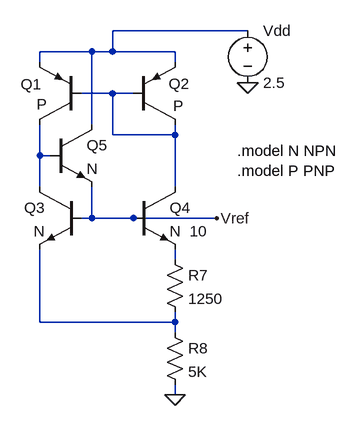
[diagram p0: schematic bandgap_reference.asc]
bandgap_reference.asc, the LTspice schematic file:
Version 4
SHEET 1 1832 680
WIRE 1696 -160 1488 -160
WIRE 1456 -128 1376 -128
WIRE 1488 -128 1488 -160
WIRE 1488 -128 1456 -128
WIRE 1584 -128 1488 -128
WIRE 1376 -112 1376 -128
WIRE 1584 -112 1584 -128
WIRE 1488 -64 1440 -64
WIRE 1520 -64 1488 -64
WIRE 1456 -16 1456 -128
WIRE 1488 0 1488 -64
WIRE 1584 0 1584 -16
WIRE 1584 0 1488 0
WIRE 1376 32 1376 -16
WIRE 1392 32 1376 32
WIRE 1376 80 1376 32
WIRE 1584 80 1584 0
WIRE 1456 128 1456 80
WIRE 1456 128 1440 128
WIRE 1520 128 1456 128
WIRE 1648 128 1520 128
WIRE 1584 192 1584 176
WIRE 1376 288 1376 176
WIRE 1584 288 1584 272
WIRE 1584 288 1376 288
WIRE 1584 304 1584 288
WIRE 1584 400 1584 384
FLAG 1584 400 0
FLAG 1648 128 Vref
FLAG 1696 -80 0
SYMBOL pnp 1440 -16 R180
WINDOW 0 61 62 Left 2
WINDOW 3 53 31 Left 2
SYMATTR InstName Q1
SYMATTR Value P
SYMBOL pnp 1520 -16 M180
WINDOW 0 54 63 Left 2
WINDOW 3 61 29 Left 2
SYMATTR InstName Q2
SYMATTR Value P
SYMBOL res 1568 176 R0
SYMATTR InstName R7
SYMATTR Value 1250
SYMBOL npn 1440 80 M0
SYMATTR InstName Q3
SYMATTR Value N
SYMBOL npn 1520 80 R0
SYMATTR InstName Q4
SYMATTR Value N  10
SYMBOL res 1568 288 R0
SYMATTR InstName R8
SYMATTR Value 5K
SYMBOL npn 1392 -16 R0
SYMATTR InstName Q5
SYMATTR Value N
SYMBOL voltage 1696 -176 R0
SYMATTR InstName Vdd
SYMATTR Value 2.5
TEXT 1680 24 Left 2 !.model N NPN\n.model P PNP

The netlist it stands for:
* bandgap_reference.asc
Q1 N003 N002 N001 0 P
Q2 N002 N002 N001 0 P
R7 N004 N005 1250
Q3 N003 Vref N005 0 N
Q4 N002 Vref N004 0 N  10
R8 N005 0 5K
Q5 N001 N003 Vref 0 N
Vdd N001 0 2.5
.model NPN NPN
.model PNP PNP
.lib standard.bjt
.model N NPN
.model P PNP
.backanno
.end